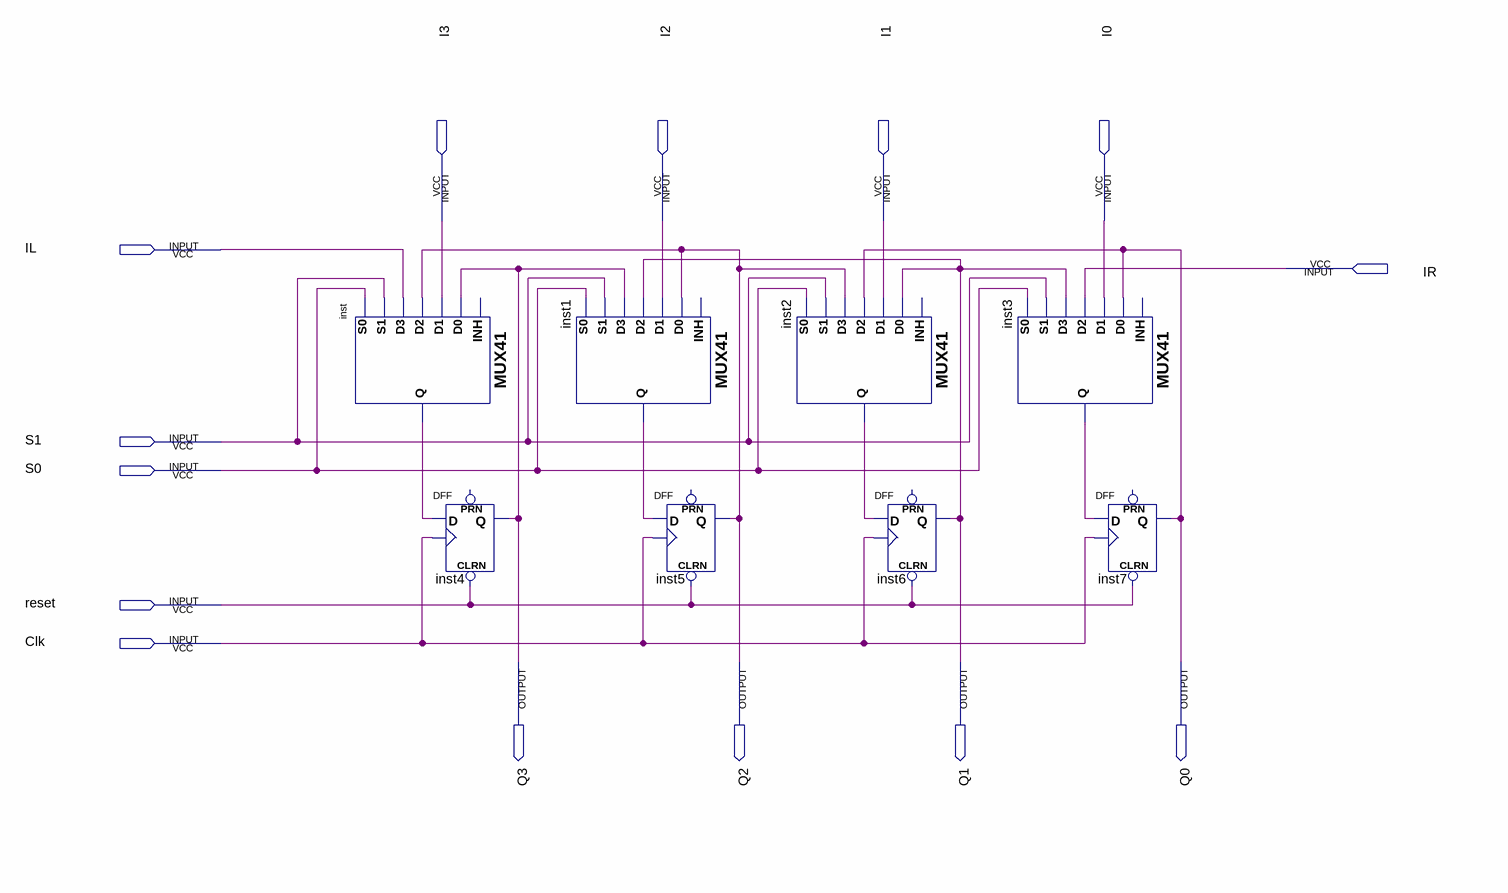
[diagram p0: schematic sheet]
// Quartus schematic SRwPL.bdf as structural Verilog: 8 symbols, 14 pins
module SRwPL (
  input  I3,
  input  I2,
  input  I1,
  input  I0,
  input  IL,
  input  IR,
  input  S1,
  input  S0,
  input  reset,
  input  Clk,
  output Q3,
  output Q2,
  output Q1,
  output Q0
);

  wire inst1_q, inst2_q, inst3_q, inst_q;

  MUX41 inst (.S0(S0), .D2(Q2), .S1(S1), .D3(IL), .D0(Q3), .D1(I3), .Q(inst_q));  // open: INH
  DFF inst4 (.CLRN(reset), .CLK(Clk), .D(inst_q), .Q(Q3));  // open: PRN
  MUX41 inst1 (.S0(S0), .D2(Q1), .S1(S1), .D3(Q3), .D0(Q2), .D1(I2), .Q(inst1_q));  // open: INH
  DFF inst5 (.CLRN(reset), .CLK(Clk), .D(inst1_q), .Q(Q2));  // open: PRN
  MUX41 inst2 (.S0(S0), .D2(Q0), .S1(S1), .D3(Q2), .D0(Q1), .D1(I1), .Q(inst2_q));  // open: INH
  DFF inst6 (.CLRN(reset), .CLK(Clk), .D(inst2_q), .Q(Q1));  // open: PRN
  MUX41 inst3 (.S0(S0), .D2(IR), .S1(S1), .D3(Q1), .D0(Q0), .D1(I0), .Q(inst3_q));  // open: INH
  DFF inst7 (.CLRN(reset), .CLK(Clk), .D(inst3_q), .Q(Q0));  // open: PRN
endmodule
